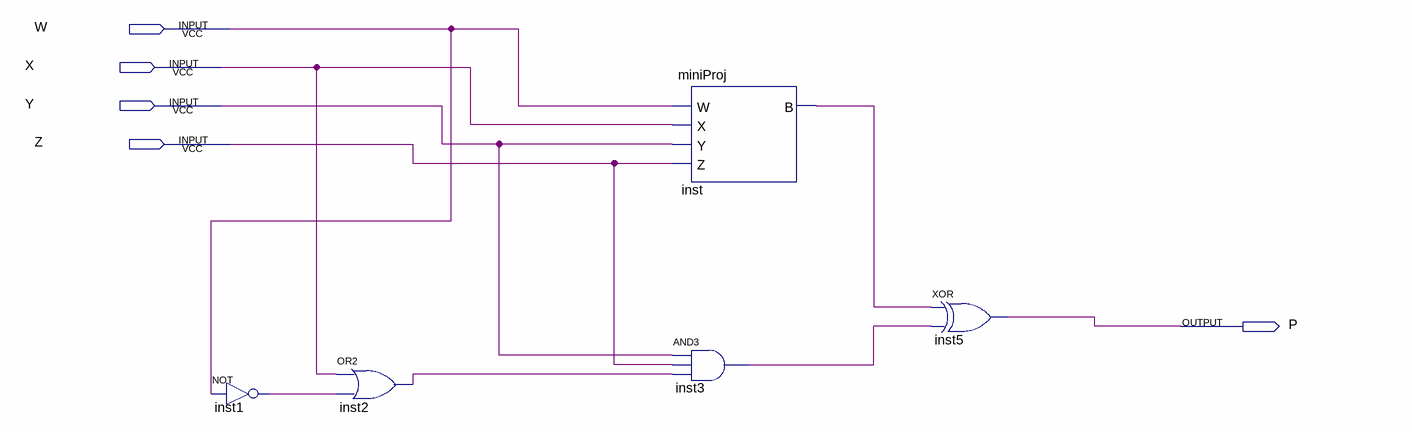
[diagram p0: schematic sheet]
// Quartus schematic mProj2.bdf as structural Verilog: 5 symbols, 5 pins
module mProj2 (
  input  W,
  input  X,
  input  Y,
  input  Z,
  output P
);

  wire inst1_out, inst2_out, inst3_out, inst_b;

  not inst1 (inst1_out, W);
  or inst2 (inst2_out, X, inst1_out);
  miniProj inst (.W(W), .X(X), .Y(Y), .Z(Z), .B(inst_b));
  and inst3 (inst3_out, Y, Z, inst2_out);
  xor inst5 (P, inst_b, inst3_out);
endmodule
